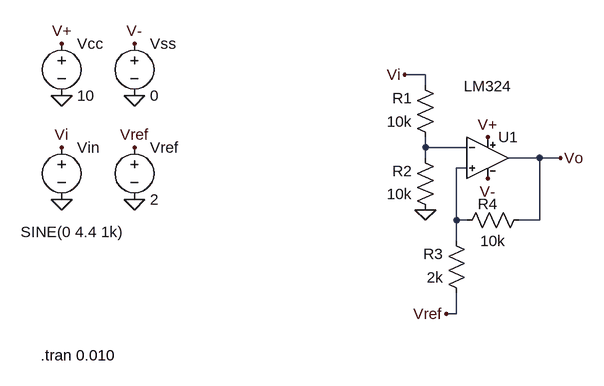
[diagram p0: schematic Circuito4.asc]
Circuito4.asc, the LTspice schematic file:
Version 4
SHEET 1 880 680
WIRE 176 -80 144 -80
WIRE 176 -64 176 -80
WIRE 176 32 176 16
WIRE 240 32 176 32
WIRE 176 48 176 32
WIRE 352 48 304 48
WIRE 384 48 352 48
WIRE 240 64 224 64
WIRE 224 144 224 64
WIRE 240 144 224 144
WIRE 352 144 352 48
WIRE 352 144 320 144
WIRE 224 176 224 144
WIRE 224 288 224 256
WIRE 224 288 208 288
FLAG 176 128 0
FLAG 144 -80 Vi
FLAG 384 48 Vo
FLAG 272 16 V+
FLAG 272 80 V-
FLAG 208 288 Vref
FLAG -272 112 0
FLAG -384 112 0
FLAG -384 -48 0
FLAG -272 -48 0
FLAG -272 32 Vref
FLAG -384 32 Vi
FLAG -384 -128 V+
FLAG -272 -128 V-
SYMBOL res 192 32 R180
WINDOW 0 36 76 Left 2
WINDOW 3 36 40 Left 2
SYMATTR InstName R1
SYMATTR Value 10k
SYMBOL res 192 144 R180
WINDOW 0 36 76 Left 2
WINDOW 3 36 40 Left 2
SYMATTR InstName R2
SYMATTR Value 10k
SYMBOL res 240 272 R180
WINDOW 0 36 76 Left 2
WINDOW 3 36 40 Left 2
SYMATTR InstName R3
SYMATTR Value 2k
SYMBOL res 224 160 R270
WINDOW 0 25 48 VTop 2
WINDOW 3 0 56 VBottom 2
SYMATTR InstName R4
SYMATTR Value 10k
SYMBOL AutoGenerated\\LM324 272 48 R0
WINDOW 3 0 -126 Top 2
SYMATTR InstName U1
SYMBOL voltage -384 -144 R0
WINDOW 123 0 0 Left 0
WINDOW 39 0 0 Left 0
SYMATTR InstName Vcc
SYMATTR Value 10
SYMBOL voltage -272 -144 R0
WINDOW 123 0 0 Left 0
WINDOW 39 0 0 Left 0
SYMATTR InstName Vss
SYMATTR Value 0
SYMBOL voltage -384 16 R0
WINDOW 3 -63 146 Left 2
WINDOW 123 -63 174 Left 2
WINDOW 39 0 0 Left 0
SYMATTR Value SINE(0 4.4 1k)
SYMATTR InstName Vin
SYMBOL voltage -272 16 R0
WINDOW 123 0 0 Left 0
WINDOW 39 0 0 Left 0
SYMATTR InstName Vref
SYMATTR Value 2
TEXT -416 352 Left 2 !.tran 0.010

The netlist it stands for:
* Circuito4.asc
R1 N001 Vi 10k
R2 0 N001 10k
R3 Vref N002 2k
R4 N002 Vo 10k
XU1 N002 N001 V+ V- Vo LM324  ; pins In+ In- V+ V- OUT
Vcc V+ 0 10
Vss V- 0 0
Vin Vi 0 SINE(0 4.4 1k)
Vref Vref 0 2
.tran 0.010
.lib E:\LtSpice_components\LM324.ti.lib
.backanno
.end